# Altium schematic sheet MEMORY.SchDoc: Network Module
size 431 x 279 mm; DrawnBy: Bin Xiao; Organization: RYSE Inc.; Revision: A
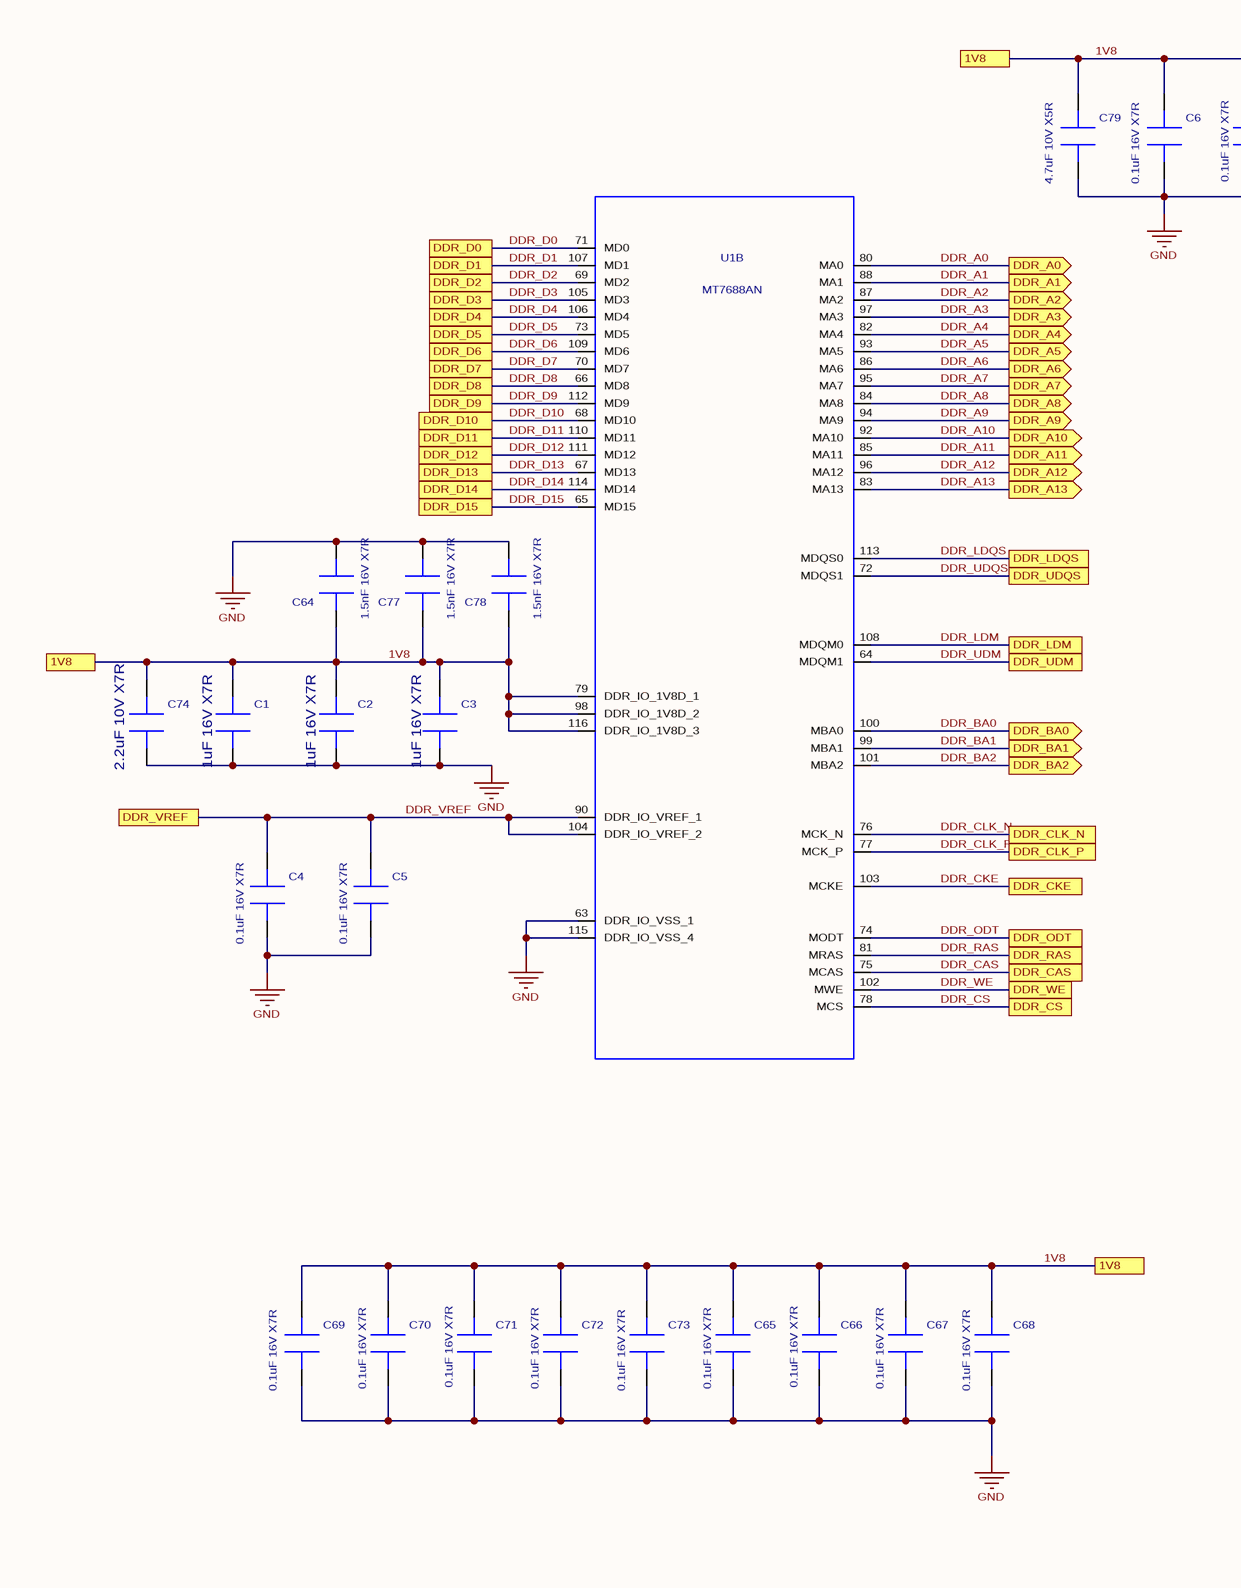
[diagram p0: MEMORY.SchDoc, left]
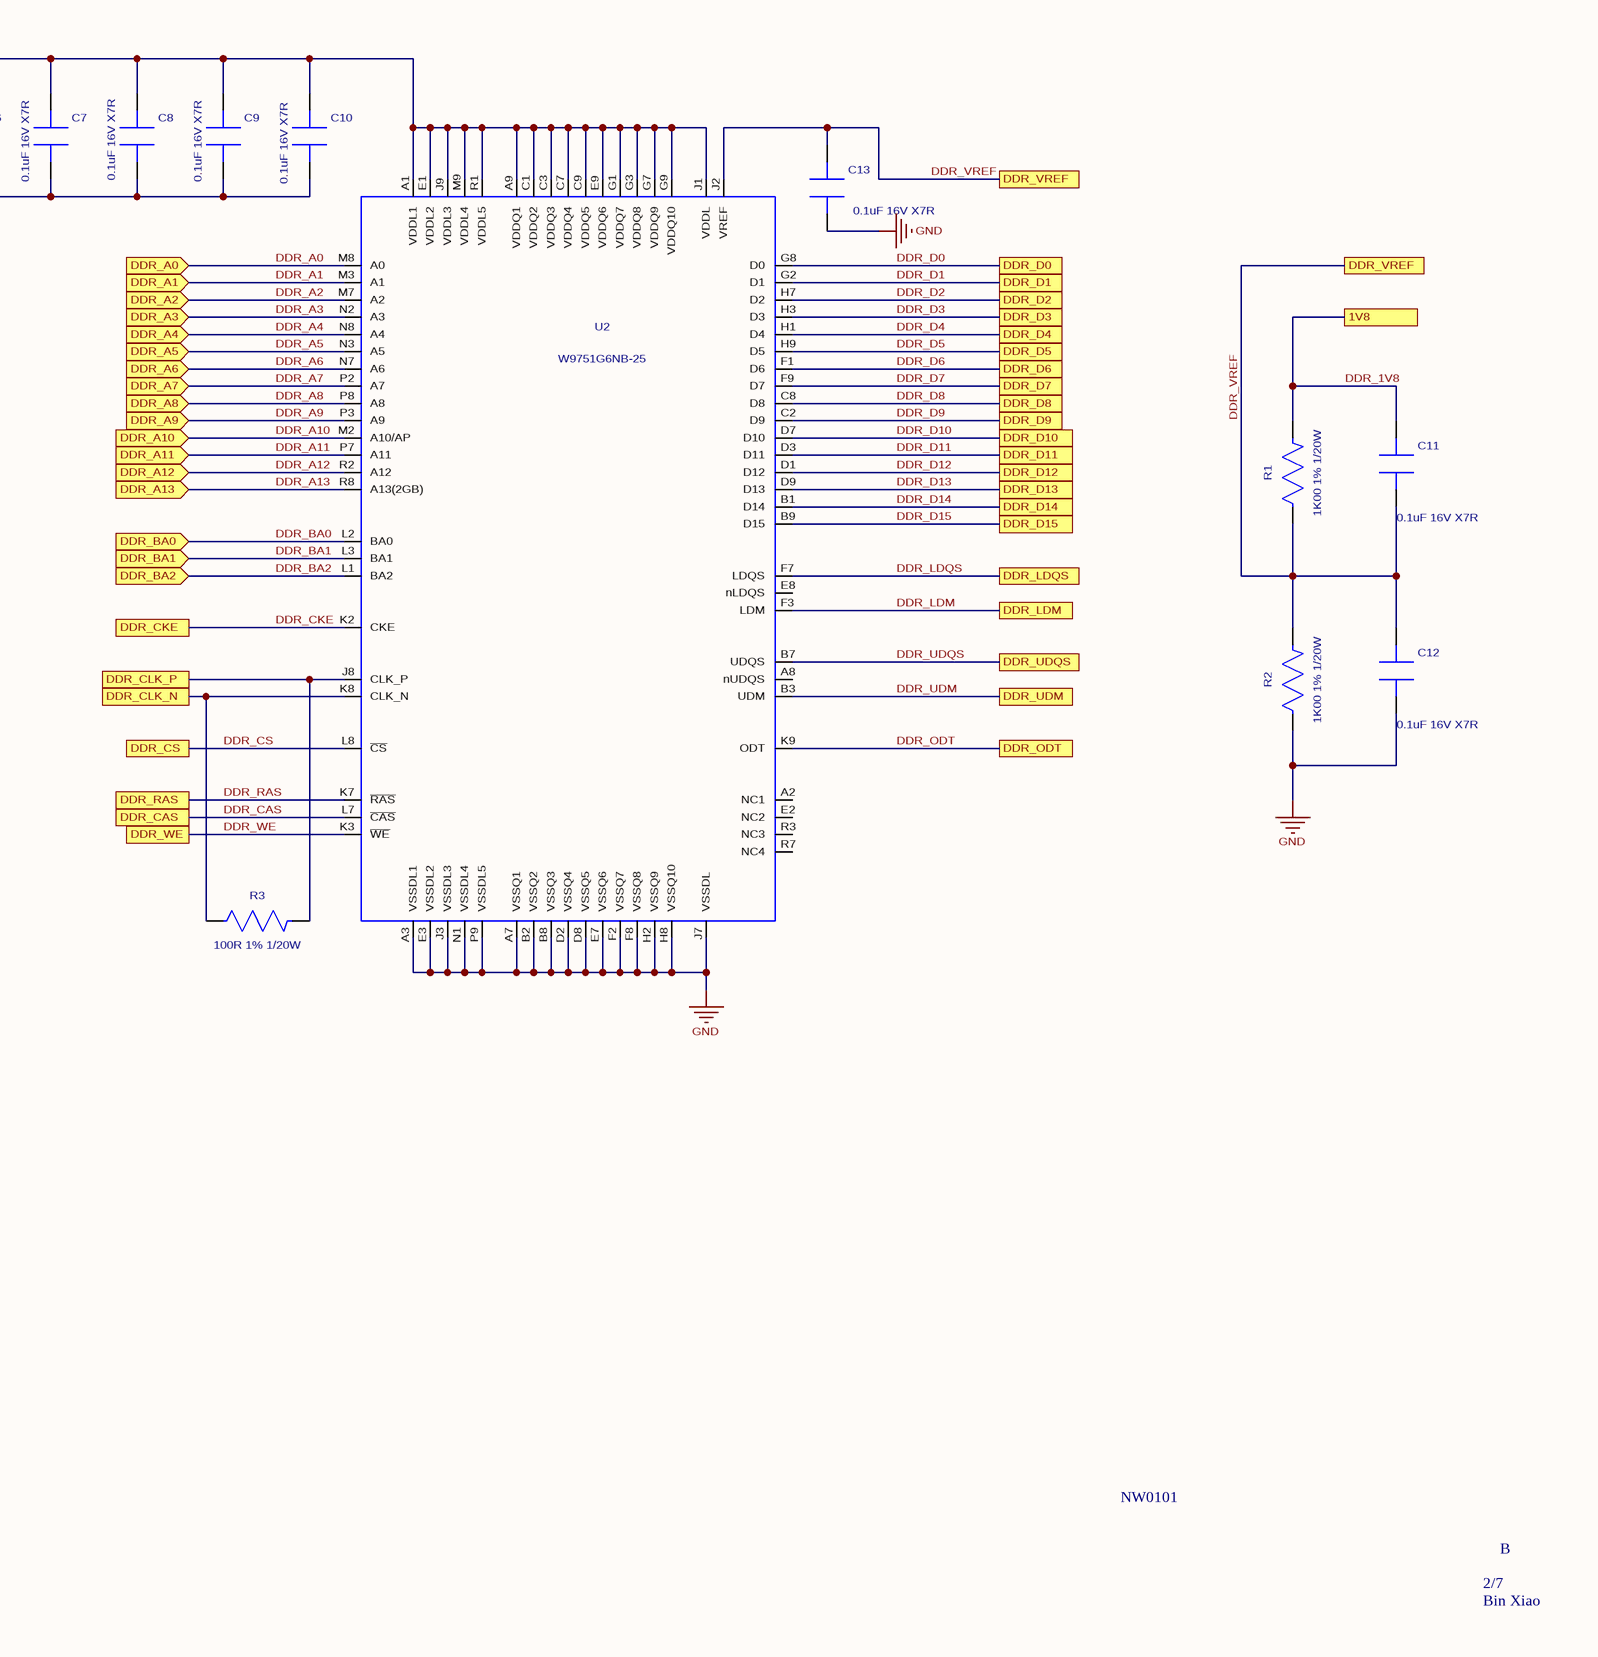
[diagram p1: MEMORY.SchDoc, right]

## Parts
C1  value 1uF 16V X7R  [C0402]  (hidden comment: CAP0402-105-6.3V-X7R)
C2  value 1uF 16V X7R  [C0402]  (hidden comment: CAP0402-105-6.3V-X7R)
C3  value 1uF 16V X7R  [C0402]  (hidden comment: CAP0402-105-6.3V-X7R)
C4  value 0.1uF 16V X7R  [C0201]  (hidden comment: CAP0201-104-16V-X7R)
C5  value 0.1uF 16V X7R  [C0201]  (hidden comment: CAP0201-104-16V-X7R)
C6  value 0.1uF 16V X7R  [C0201]  (hidden comment: CAP0201-104-16V-X7R)
C7  value 0.1uF 16V X7R  [C0201]  (hidden comment: CAP0201-104-16V-X7R)
C8  value 0.1uF 16V X7R  [C0201]  (hidden comment: CAP0201-104-16V-X7R)
C9  value 0.1uF 16V X7R  [C0201]  (hidden comment: CAP0201-104-16V-X7R)
C10  value 0.1uF 16V X7R  [C0201]  (hidden comment: CAP0201-104-16V-X7R)
C11  value 0.1uF 16V X7R  [C0201]  (hidden comment: CAP0201-104-16V-X7R)
C12  value 0.1uF 16V X7R  [C0201]  (hidden comment: CAP0201-104-16V-X7R)
C13  value 0.1uF 16V X7R  [C0201]  (hidden comment: CAP0201-104-16V-X7R)
C64  value 1.5nF 16V X7R  [C0201]  (hidden comment: CAP0201-152-16V-X7R)
C65  value 0.1uF 16V X7R  [C0201]  (hidden comment: CAP0201-104-16V-X7R)
C66  value 0.1uF 16V X7R  [C0201]  (hidden comment: CAP0201-104-16V-X7R)
C67  value 0.1uF 16V X7R  [C0201]  (hidden comment: CAP0201-104-16V-X7R)
C68  value 0.1uF 16V X7R  [C0201]  (hidden comment: CAP0201-104-16V-X7R)
C69  value 0.1uF 16V X7R  [C0201]  (hidden comment: CAP0201-104-16V-X7R)
C70  value 0.1uF 16V X7R  [C0201]  (hidden comment: CAP0201-104-16V-X7R)
C71  value 0.1uF 16V X7R  [C0201]  (hidden comment: CAP0201-104-16V-X7R)
C72  value 0.1uF 16V X7R  [C0201]  (hidden comment: CAP0201-104-16V-X7R)
C73  value 0.1uF 16V X7R  [C0201]  (hidden comment: CAP0201-104-16V-X7R)
C74  value 2.2uF 10V X7R  [C0402]  (hidden comment: CAP0402-225-6.3V-X7R)
C77  value 1.5nF 16V X7R  [C0201]  (hidden comment: CAP0201-152-16V-X7R)
C78  value 1.5nF 16V X7R  [C0201]  (hidden comment: CAP0201-152-16V-X7R)
C79  value 4.7uF 10V X5R  [C0402]  (hidden comment: CAP0402-475-10V-X5R)
R1  value 1K00 1% 1/20W  [R0201]  (hidden comment: RES0201-1K00)
R2  value 1K00 1% 1/20W  [R0201]  (hidden comment: RES0201-1K00)
R3  value 100R 1% 1/20W  [R0201]  (hidden comment: RES0201-100R)
U1  MT7688AN  [DR-QFN-128]  (part B of 6)
U2  W9751G6NB-25  [TWBGA-84_8X12P5_ISI]

## Ports
1V8, DDR_A0 (in), DDR_A0 (out), DDR_A1 (in), DDR_A1 (out), DDR_A2 (in), DDR_A2 (out), DDR_A3 (in), DDR_A3 (out), DDR_A4 (in), DDR_A4 (out), DDR_A5 (in), DDR_A5 (out), DDR_A6 (in), DDR_A6 (out), DDR_A7 (in), DDR_A7 (out), DDR_A8 (in), DDR_A8 (out), DDR_A9 (in), DDR_A9 (out), DDR_A10 (in), DDR_A10 (out), DDR_A11 (in), DDR_A11 (out), DDR_A12 (in), DDR_A12 (out), DDR_A13 (in), DDR_A13 (out), DDR_BA0 (in), DDR_BA0 (out), DDR_BA1 (in), DDR_BA1 (out), DDR_BA2 (in), DDR_BA2 (out), DDR_CAS, DDR_CKE, DDR_CLK_N, DDR_CLK_P, DDR_CS, DDR_D0, DDR_D1, DDR_D2, DDR_D3, DDR_D4, DDR_D5, DDR_D6, DDR_D7, DDR_D8, DDR_D9, DDR_D10, DDR_D11, DDR_D12, DDR_D13, DDR_D14, DDR_D15, DDR_LDM, DDR_LDQS, DDR_ODT, DDR_RAS, DDR_UDM, DDR_UDQS, DDR_VREF, DDR_WE

## Nets
GND: C1.2 C2.2 C3.2 C4.2 C5.2 C6.2 C7.2 C8.2 C9.2 C10.2 C12.2 C13.2 C64.2 C65.2 C66.2 C67.2 C68.2 C69.2 C70.2 C71.2 C72.2 C73.2 C74.2 C77.2 C78.2 C79.2 R2.1 U1.63(DDR_IO_VSS_1) U1.115(DDR_IO_VSS_4) U2.A3(VSSDL1) U2.A7(VSSQ1) U2.B2(VSSQ2) U2.B8(VSSQ3) U2.D2(VSSQ4) U2.D8(VSSQ5) U2.E3(VSSDL2) U2.E7(VSSQ6) U2.F2(VSSQ7) U2.F8(VSSQ8) U2.H2(VSSQ9) U2.H8(VSSQ10) U2.J3(VSSDL3) U2.J7(VSSDL) U2.N1(VSSDL4) U2.P9(VSSDL5)
1V8: C1.1 C2.1 C3.1 C6.1 C7.1 C8.1 C9.1 C10.1 C11.1 C64.1 C65.1 C66.1 C67.1 C68.1 C69.1 C70.1 C71.1 C72.1 C73.1 C74.1 C77.1 C78.1 C79.1 R1.2 U1.79(DDR_IO_1V8D_1) U1.98(DDR_IO_1V8D_2) U1.116(DDR_IO_1V8D_3) U2.A1(VDDL1) U2.A9(VDDQ1) U2.C1(VDDQ2) U2.C3(VDDQ3) U2.C7(VDDQ4) U2.C9(VDDQ5) U2.E1(VDDL2) U2.E9(VDDQ6) U2.G1(VDDQ7) U2.G3(VDDQ8) U2.G7(VDDQ9) U2.G9(VDDQ10) U2.J1(VDDL) U2.J9(VDDL3) U2.M9(VDDL4) U2.R1(VDDL5) ; port 1V8  [also labelled DDR_1V8]
DDR_A0: U1.80(MA0) U2.M8(A0) ; port DDR_A0
DDR_A1: U1.88(MA1) U2.M3(A1) ; port DDR_A1
DDR_A2: U1.87(MA2) U2.M7(A2) ; port DDR_A2
DDR_A3: U1.97(MA3) U2.N2(A3) ; port DDR_A3
DDR_A4: U1.82(MA4) U2.N8(A4) ; port DDR_A4
DDR_A5: U1.93(MA5) U2.N3(A5) ; port DDR_A5
DDR_A6: U1.86(MA6) U2.N7(A6) ; port DDR_A6
DDR_A7: U1.95(MA7) U2.P2(A7) ; port DDR_A7
DDR_A8: U1.84(MA8) U2.P8(A8) ; port DDR_A8
DDR_A9: U1.94(MA9) U2.P3(A9) ; port DDR_A9
DDR_A10: U1.92(MA10) U2.M2(A10/AP) ; port DDR_A10
DDR_A11: U1.85(MA11) U2.P7(A11) ; port DDR_A11
DDR_A12: U1.96(MA12) U2.R2(A12) ; port DDR_A12
DDR_A13: U1.83(MA13) U2.R8(A13(2GB)) ; port DDR_A13
DDR_BA0: U1.100(MBA0) U2.L2(BA0) ; port DDR_BA0
DDR_BA1: U1.99(MBA1) U2.L3(BA1) ; port DDR_BA1
DDR_BA2: U1.101(MBA2) U2.L1(BA2) ; port DDR_BA2
DDR_CAS: U1.75(MCAS) U2.L7(~{CAS}) ; port DDR_CAS
DDR_CKE: U1.103(MCKE) U2.K2(CKE) ; port DDR_CKE
DDR_CLK_N: R3.1 U1.76(MCK_N) U2.K8(CLK_N) ; port DDR_CLK_N
DDR_CLK_P: R3.2 U1.77(MCK_P) U2.J8(CLK_P) ; port DDR_CLK_P
DDR_CS: U1.78(MCS) U2.L8(~{CS}) ; port DDR_CS
DDR_D0: U1.71(MD0) U2.G8(D0) ; port DDR_D0
DDR_D1: U1.107(MD1) U2.G2(D1) ; port DDR_D1
DDR_D2: U1.69(MD2) U2.H7(D2) ; port DDR_D2
DDR_D3: U1.105(MD3) U2.H3(D3) ; port DDR_D3
DDR_D4: U1.106(MD4) U2.H1(D4) ; port DDR_D4
DDR_D5: U1.73(MD5) U2.H9(D5) ; port DDR_D5
DDR_D6: U1.109(MD6) U2.F1(D6) ; port DDR_D6
DDR_D7: U1.70(MD7) U2.F9(D7) ; port DDR_D7
DDR_D8: U1.66(MD8) U2.C8(D8) ; port DDR_D8
DDR_D9: U1.112(MD9) U2.C2(D9) ; port DDR_D9
DDR_D10: U1.68(MD10) U2.D7(D10) ; port DDR_D10
DDR_D11: U1.110(MD11) U2.D3(D11) ; port DDR_D11
DDR_D12: U1.111(MD12) U2.D1(D12) ; port DDR_D12
DDR_D13: U1.67(MD13) U2.D9(D13) ; port DDR_D13
DDR_D14: U1.114(MD14) U2.B1(D14) ; port DDR_D14
DDR_D15: U1.65(MD15) U2.B9(D15) ; port DDR_D15
DDR_LDM: U1.108(MDQM0) U2.F3(LDM) ; port DDR_LDM
DDR_LDQS: U1.113(MDQS0) U2.F7(LDQS) ; port DDR_LDQS
DDR_ODT: U1.74(MODT) U2.K9(ODT) ; port DDR_ODT
DDR_RAS: U1.81(MRAS) U2.K7(~{RAS}) ; port DDR_RAS
DDR_UDM: U1.64(MDQM1) U2.B3(UDM) ; port DDR_UDM
DDR_UDQS: U1.72(MDQS1) U2.B7(UDQS) ; port DDR_UDQS
DDR_VREF: C4.1 C5.1 C11.2 C12.1 C13.1 R1.1 R2.2 U1.90(DDR_IO_VREF_1) U1.104(DDR_IO_VREF_2) U2.J2(VREF) ; port DDR_VREF
DDR_WE: U1.102(MWE) U2.K3(~{WE}) ; port DDR_WE

Not connected (* = marked no-connect by the designer): U2 A2(NC1) A8(nUDQS) E2(NC2) E8(nLDQS) R3(NC3) R7(NC4)

## Notes on the sheet
- NW0101
- 2/7
- B
- Bin Xiao

## Library data of the parts
C1-C3 = CAP0402-105-6.3V-X7R: CAP CER 1UF 6.3V X7R 0402; Part Number: GRM155R70J105KA12D; Manufacturer: Murata Electronics; Prefered Vender: Digikey; Aligni Value: 1u; Type: Capacitor; Geometry.Height: 0.33mm; PCB DECAL: RC0402; Revision: A
C4-C13 C65-C73 = CAP0201-104-16V-X7R: CAP CER 0.1UF 16V X7R 0201; Part Number: GRM033Z71C104KE14D; Manufacturer: Murata Electronics; Prefered Vender: Digikey; Aligni Value: 0.1u; Type: Capacitor; Geometry.Height: 0.33mm; PCB DECAL: RC0201; Revision: A
C64 C77 C78 = CAP0201-152-16V-X7R: CAP CER 1500PF 16V X7R 0201; Part Number: CGA1A2X7R1C152K030BA; Manufacturer: TDK Corporation; Prefered Vender: Digikey; Aligni Value: 1.5n; Type: Capacitor; Geometry.Height: 0.33mm; PCB DECAL: RC0201; Revision: A
C74 = CAP0402-225-6.3V-X7R: CAP CER 2.2UF 10V X7R 0402; Part Number: GRM155Z71A225KE01D; Manufacturer: Murata Electronics; Prefered Vender: Digikey; Aligni Value: 2.2u; Type: Capacitor; Geometry.Height: 0.33mm; PCB DECAL: RC0402; Revision: A
C79 = CAP0402-475-10V-X5R: CAP CER 4.7UF 10V X5R 0402; Part Number: CL05A475MP5NRNC; Manufacturer: Samsung Electro-Mechanics; Prefered Vender: Digikey; Aligni Value: 4.7u; Type: Capacitor; Geometry.Height: 0.33mm; PCB DECAL: RC0402; Revision: A
R1 R2 = RES0201-1K00: RES 1K OHM 1% 1/20W 0201; Part Number: RMCF0201FT1K00; Manufacturer: Stackpole Electronics Inc; Prefered Vender: Digikey; Geometry.Height: 0.6mm; PCB DECAL: RC0201; Aligni Value: 1k; Revision: A; Type: Resistor
R3 = RES0201-100R: RES 100 OHM 1% 1/20W 0201; Manufacturer: Yageo; Part Number: RC0201FR-07100RL; Geometry.Height: 0.5mm; Prefered Vender: Digikey; Aligni Value: 100; PCB DECAL: RC0201; Type: Resistor; Revision: A
U1 = MT7688AN: 580Mhz 32bits Networking Processor; Manufacturer: MediaTek Inc; Geometry.Height: 0mm; Type: IC; Part Number: MT7688AN; PCB DECAL: DR-QFN-128
U2 = W9751G6NB-25: IC DRAM 512MBIT PARALLEL 84VFBGA; Manufacturer: Winbond Electronics; Prefered Vender: Digikey; PCB DECAL: TWBGA-84_8X12P5_ISI; Part Number: W9751G6NB-25; Type: IC